# Altium schematic sheet DX-PJ14-V1.1_SCH_Part_AD.SchDoc
size A4
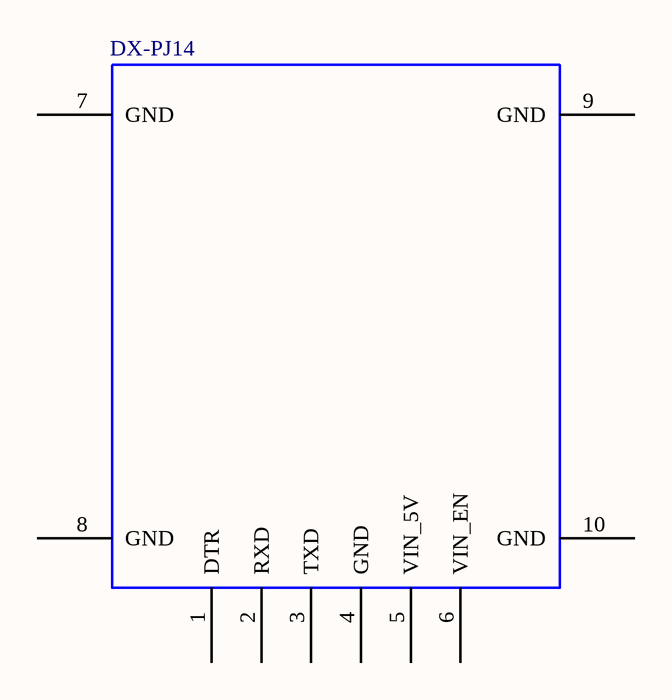
[diagram p0: DX-PJ14-V1.1_SCH_Part_AD.SchDoc]

## Parts
DX-PJ14  Component_1  (value not drawn)

## Nets

Not connected (* = marked no-connect by the designer): DX-PJ14 1(DTR) 2(RXD) 3(TXD) 4(GND) 5(VIN_5V) 6(VIN_EN) 7(GND) 8(GND) 9(GND) 10(GND)